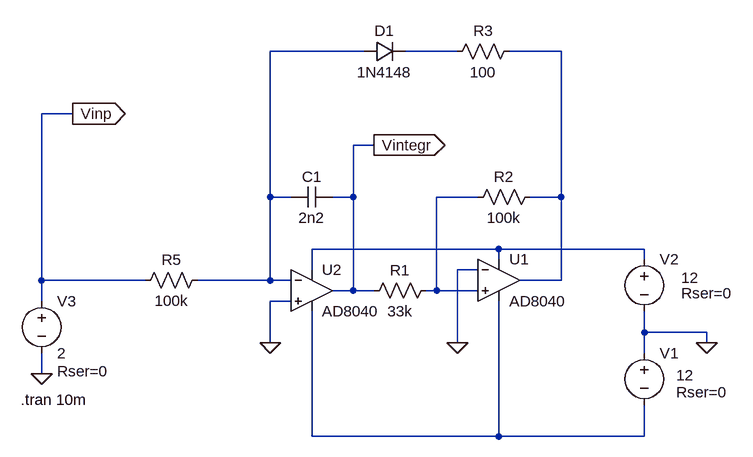
[diagram p0: schematic VCO_singleslope.asc]
VCO_singleslope.asc, the LTspice schematic file:
Version 4
SHEET 1 1024 680
WIRE 128 -192 -16 -192
WIRE 272 -192 192 -192
WIRE 432 -192 352 -192
WIRE -320 -96 -368 -96
WIRE 144 -48 112 -48
WIRE -16 32 -16 -192
WIRE 16 32 -16 32
WIRE 112 32 112 -48
WIRE 112 32 80 32
WIRE 304 32 240 32
WIRE 432 32 432 -192
WIRE 432 32 384 32
WIRE 336 112 48 112
WIRE 560 112 336 112
WIRE 336 128 336 112
WIRE 560 128 560 112
WIRE 48 144 48 112
WIRE 304 144 272 144
WIRE -368 160 -368 -96
WIRE -208 160 -368 160
WIRE -16 160 -16 32
WIRE -16 160 -128 160
WIRE 16 160 -16 160
WIRE 432 160 432 32
WIRE 432 160 368 160
WIRE 112 176 112 32
WIRE 112 176 80 176
WIRE 144 176 112 176
WIRE 240 176 240 32
WIRE 240 176 224 176
WIRE 304 176 240 176
WIRE -368 192 -368 160
WIRE 16 192 -16 192
WIRE 560 240 560 208
WIRE 656 240 560 240
WIRE -16 256 -16 192
WIRE 272 256 272 144
WIRE 656 256 656 240
WIRE 560 272 560 240
WIRE -368 304 -368 272
WIRE 48 400 48 208
WIRE 336 400 336 192
WIRE 336 400 48 400
WIRE 560 400 560 352
WIRE 560 400 336 400
FLAG 656 256 0
FLAG -16 256 0
FLAG -368 304 0
FLAG -320 -96 Vinp
IOPIN -320 -96 Out
FLAG 144 -48 Vintegr
IOPIN 144 -48 Out
FLAG 272 256 0
SYMBOL cap 80 16 R90
WINDOW 0 0 32 VBottom 2
WINDOW 3 32 32 VTop 2
SYMATTR InstName C1
SYMATTR Value 2n2
SYMBOL voltage 560 256 R0
WINDOW 3 49 50 Left 2
WINDOW 123 0 0 Left 0
WINDOW 39 49 76 Left 2
SYMATTR Value 12
SYMATTR SpiceLine Rser=0
SYMATTR InstName V1
SYMBOL voltage 560 112 R0
WINDOW 3 57 44 Left 2
WINDOW 123 0 0 Left 0
WINDOW 39 57 68 Left 2
SYMATTR Value 12
SYMATTR SpiceLine Rser=0
SYMATTR InstName V2
SYMBOL voltage -368 176 R0
WINDOW 123 0 0 Left 0
WINDOW 39 24 124 Left 2
SYMATTR SpiceLine Rser=0
SYMATTR InstName V3
SYMATTR Value 2
SYMBOL res -112 144 R90
WINDOW 0 0 56 VBottom 2
WINDOW 3 32 56 VTop 2
SYMATTR InstName R5
SYMATTR Value 100k
SYMBOL Opamps\\AD8040 336 96 R0
SYMATTR InstName U1
SYMBOL Opamps\\AD8040 48 112 R0
SYMATTR InstName U2
SYMBOL res 400 16 R90
WINDOW 0 0 56 VBottom 2
WINDOW 3 32 56 VTop 2
SYMATTR InstName R2
SYMATTR Value 100k
SYMBOL diode 128 -176 R270
WINDOW 0 32 32 VTop 2
WINDOW 3 0 32 VBottom 2
SYMATTR InstName D1
SYMATTR Value 1N4148
SYMBOL res 240 160 R90
WINDOW 0 0 56 VBottom 2
WINDOW 3 32 56 VTop 2
SYMATTR InstName R1
SYMATTR Value 33k
SYMBOL res 368 -208 R90
WINDOW 0 0 56 VBottom 2
WINDOW 3 32 56 VTop 2
SYMATTR InstName R3
SYMATTR Value 100
TEXT -400 344 Left 2 !.tran 10m

The netlist it stands for:
* VCO_singleslope.asc
C1 Vintegr N001 2n2
V1 0 N006 12 Rser=0
V2 N005 0 12 Rser=0
V3 Vinp 0 2 Rser=0
R5 N001 Vinp 100k
XU1 N004 0 N005 N006 N003 AD8040  ; pins In+ In- V+ V- OUT
XU2 0 N001 N005 N006 Vintegr AD8040  ; pins In+ In- V+ V- OUT
R2 N003 N004 100k
D1 N001 N002 1N4148
R1 N004 Vintegr 33k
R3 N003 N002 100
.model D D
.lib standard.dio
.tran 10m
.backanno
.end